# Altium schematic sheet CAN.SchDoc
size A
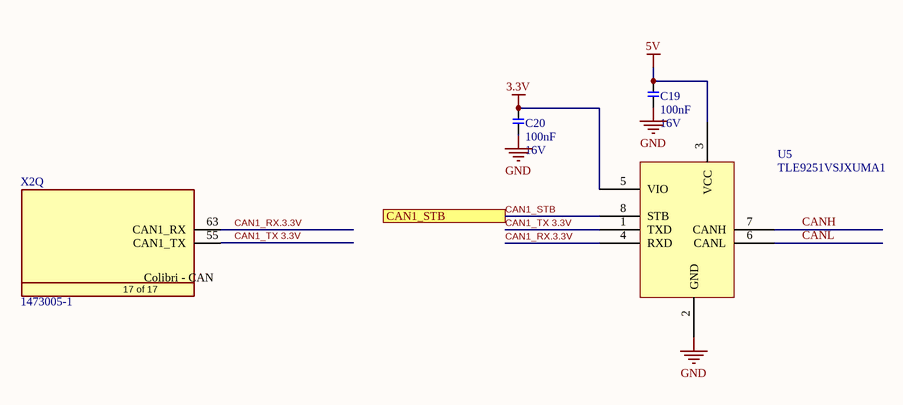
[diagram p0: CAN.SchDoc]

## Parts
C19  Rating: 16V  [T_CAPC0603X33N]  (hidden comment: 100nF)
C20  Rating: 16V  [T_CAPC0603X33N]  (hidden comment: 100nF)
U5  TLE9251VSJXUMA1
X2  1473005-1  [T_Tyco_1473005-1]  (part Q of 17)

## Ports
CAN1_STB

## Nets
3.3V: C20.2 U5.5(VIO)
5V: C19.2 U5.3(VCC)
GND: C19.1 C20.1 U5.2(GND)
CAN1_RX.3.3V: U5.4(RXD) X2.63(CAN1_RX)
CAN1_STB: U5.8(STB) ; port CAN1_STB
CAN1_TX 3.3V: U5.1(TXD) X2.55(CAN1_TX)
CANH: U5.7(CANH)
CANL: U5.6(CANL)

## Notes on the sheet
- (in symbol CON-Tyco-1473005-1-200-0.6mm, part Q) Colibri - CAN; 17 of 17

## Library data of the parts
C19 C20 = C-X7R-100nF-16V-10%-0603: Capacitor Ceramic X7R 100nF 16V 10% 0603; Tolerance: 10%; Type: X7R; Value: 100nF
X2 = CON-Tyco-1473005-1-200-0.6mm: SODIMM Connector; Manufacturer Name: Tyco; No. of ways: 200; Manufacturer Part No.: 1473005-1